# EAGLE schematic rcio_v2 (EAGLE 9.6.2)
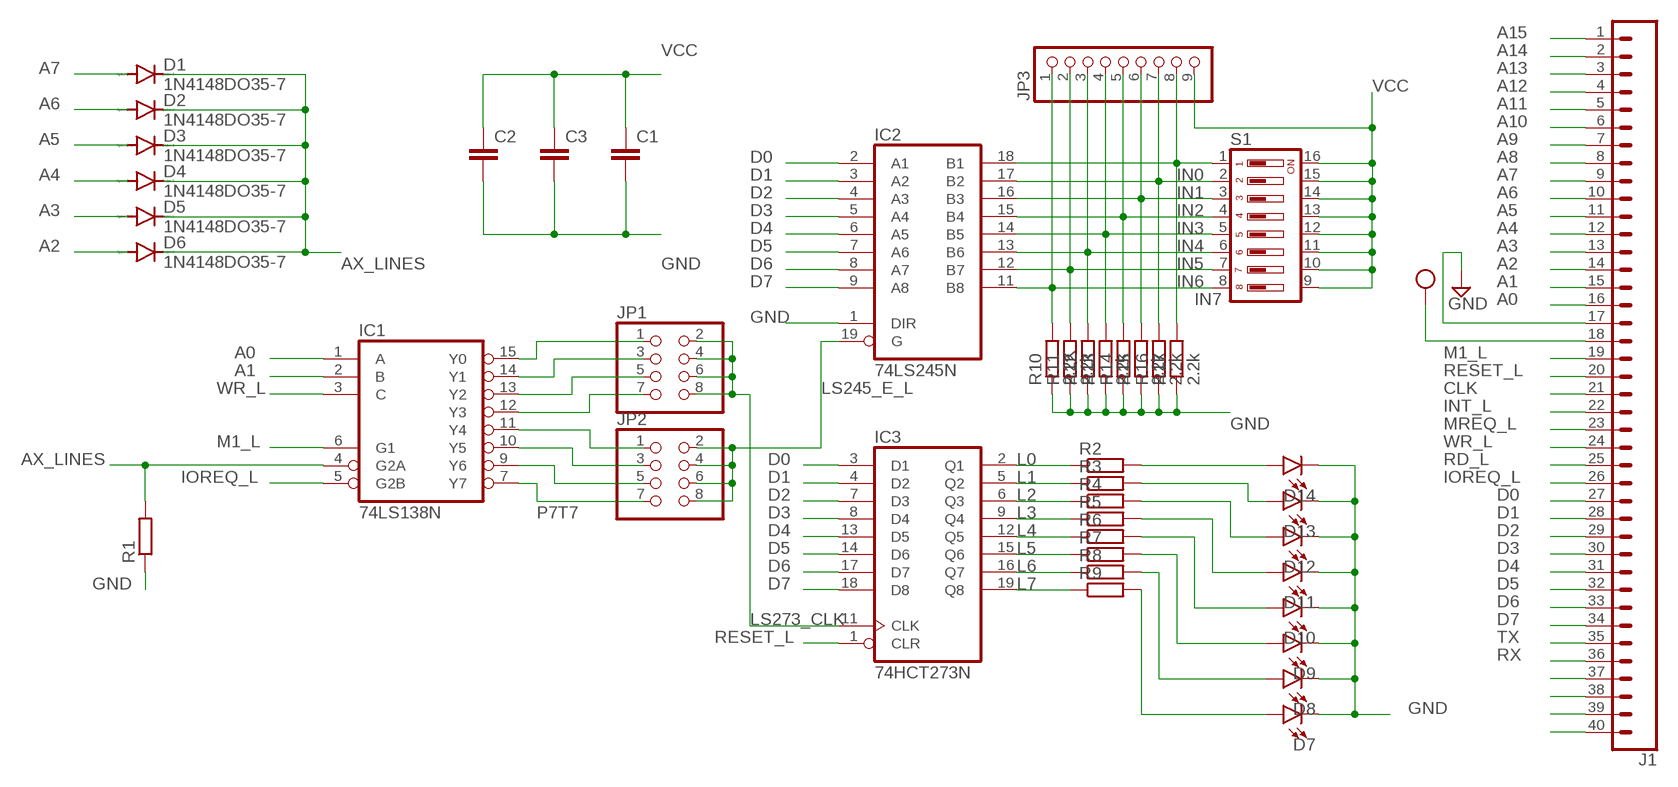
[diagram p0: schematic, sheet 1]

## Parts
C1  C-EU050-025X075  [C050-025X075]
C2  C-EU050-025X075  [C050-025X075]
C3  C-EU050-025X075  [C050-025X075]
D1  1N4148DO35-7  [DO35-7]
D2  1N4148DO35-7  [DO35-7]
D3  1N4148DO35-7  [DO35-7]
D4  1N4148DO35-7  [DO35-7]
D5  1N4148DO35-7  [DO35-7]
D6  1N4148DO35-7  [DO35-7]
D7  LED3MM  [LED_3MM]
D8  LED3MM  [LED_3MM]
D9  LED3MM  [LED_3MM]
D10  LED3MM  [LED_3MM]
D11  LED3MM  [LED_3MM]
D12  LED3MM  [LED_3MM]
D13  LED3MM  [LED_3MM]
D14  LED3MM  [LED_3MM]
IC1  74LS138N  [DIL16]
IC2  74LS245N  [DIL20]
IC3  74HCT273N  [DIL20]
J1  CONN_40OFFSET  [1X40_OFFSET]
JP1  PINHD-2X4  [2X04]
JP2  PINHD-2X4  [2X04]
JP3  PINHD-1X9  [1X09]
R1  R-EU_0204/7  [0204/7]
R2  R-EU_0204/7  [0204/7]
R3  R-EU_0204/7  [0204/7]
R4  R-EU_0204/7  [0204/7]
R5  R-EU_0204/7  [0204/7]
R6  R-EU_0204/7  [0204/7]
R7  R-EU_0204/7  [0204/7]
R8  R-EU_0204/7  [0204/7]
R9  R-EU_0204/7  [0204/7]
R10  2.2K  R-EU_0204/7  [0204/7]
R11  2.2k  R-EU_0204/7  [0204/7]
R12  R-EU_0204/7  [0204/7]
R13  2.2k  R-EU_0204/7  [0204/7]
R14  R-EU_0204/7  [0204/7]
R15  2.2k  R-EU_0204/7  [0204/7]
R16  2.2k  R-EU_0204/7  [0204/7]
R17  2.2k  R-EU_0204/7  [0204/7]
S1  DP08  [DP-08]

## Nets
A0: IC1.1(A) J1.16
A1: IC1.2(B) J1.15
A2: D6.A J1.14
A3: D5.A J1.13
A4: D4.A J1.12
A5: D3.A J1.11
A6: D2.A J1.10
A7: D1.A J1.9
A8: J1.8
A9: J1.7
A10: J1.6
A11: J1.5
A12: J1.4
A13: J1.3
A14: J1.2
A15: J1.1
AX_LINES: D1.C D2.C D3.C D4.C D5.C D6.C IC1.4(G2A) R1.2
CLK: J1.21
D0: IC2.2(A1) IC3.3(D1) J1.27
D1: IC2.3(A2) IC3.4(D2) J1.28
D2: IC2.4(A3) IC3.7(D3) J1.29
D3: IC2.5(A4) IC3.8(D4) J1.30
D4: IC2.6(A5) IC3.13(D5) J1.31
D5: IC2.7(A6) IC3.14(D6) J1.32
D6: IC2.8(A7) IC3.17(D7) J1.33
D7: IC2.9(A8) IC3.18(D8) J1.34
GND: C1.2 C2.2 C3.2 D7.K(C) D8.K(C) D9.K(C) D10.K(C) D11.K(C) D12.K(C) D13.K(C) D14.K(C) IC2.1(DIR) J1.17 R1.1 R10.1 R11.1 R12.1 R13.1 R14.1 R15.1 R16.1 R17.1
IN0: IC2.18(B1) JP3.8 R17.2 S1.1
IN1: IC2.17(B2) JP3.7 R16.2 S1.2
IN2: IC2.16(B3) JP3.6 R15.2 S1.3
IN3: IC2.15(B4) JP3.5 R14.2 S1.4
IN4: IC2.14(B5) JP3.4 R13.2 S1.5
IN5: IC2.13(B6) JP3.3 R12.2 S1.6
IN6: IC2.12(B7) JP3.2 R11.2 S1.7
IN7: IC2.11(B8) JP3.1 R10.2 S1.8
INT_L: J1.22
IOREQ_L: IC1.5(G2B) J1.26
L0: IC3.2(Q1) R2.1
L1: IC3.5(Q2) R3.1
L2: IC3.6(Q3) R4.1
L3: IC3.9(Q4) R5.1
L4: IC3.12(Q5) R6.1
L5: IC3.15(Q6) R7.1
L6: IC3.16(Q7) R8.1
L7: IC3.19(Q8) R9.1
LED7: D7.A R9.2
LS245_E_L: IC2.19(G) JP2.2 JP2.4 JP2.6 JP2.8
LS273_CLK: IC3.11(CLK) JP1.2 JP1.4 JP1.6 JP1.8
M1_L: IC1.6(G1) J1.19
MREQ_L: J1.23
N$1: J1.37
N$2: J1.38
N$3: J1.39
N$4: IC1.15(Y0) JP1.1
N$5: IC1.14(Y1) JP1.3
N$6: IC1.13(Y2) JP1.5
N$7: IC1.12(Y3) JP1.7
N$8: IC1.11(Y4) JP2.1
N$9: IC1.10(Y5) JP2.3
N$10: IC1.9(Y6) JP2.5
N$13: J1.40
N$23: D14.A R2.2
N$24: D13.A R3.2
N$25: D12.A R4.2
N$26: D11.A R5.2
N$27: D10.A R6.2
N$28: D9.A R7.2
N$29: D8.A R8.2
P7T7: IC1.7(Y7) JP2.7
RD_L: J1.25
RESET_L: IC3.1(CLR) J1.20
RX: J1.36
TX: J1.35
VCC: C1.1 C2.1 C3.1 J1.18 JP3.9 S1.9 S1.10 S1.11 S1.12 S1.13 S1.14 S1.15 S1.16
WR_L: IC1.3(C) J1.24

## Power pins joined to a net without a drawn wire
GND: IC1.8(GND) IC2.10(GND) IC3.10(GND)
VCC: IC1.16(VCC) IC2.20(VCC) IC3.20(VCC)

## Library data of the parts
C1 = rcl:C-EU: CAPACITOR, European symbol; SPICEPREFIX: C
C2 C3 = LabE:C-EU: CAPACITOR, European symbol; SPICEPREFIX: C
D1-D6 = diode:1N4148: DIODE high speed (Philips)
D7-D14 = SparkFun-LED:LED: LED (Generic) Standard schematic elements and footprints for 5mm, 3mm, 1206, and 0603 sized LEDs. Generic LEDs with no color specified.; PROD_ID: DIO-08794
IC1 = 74xx-eu:74*138: 3-line to 8-line DECODER/DEMULTIPLEXER
IC2 = 74xx-eu:74*245: Octal BUS TRANSCEIVER, 3-state
IC3 = 74xx-eu:74*273: Octal D type FLIP FLOP, clear
J1 = SparkFun-Connectors:CONN_40: Multi connection point. Often used as Generic Header-pin footprint for 0.1 inch spaced/style header connections On any of the 0.1 inch spaced packages, you can populate with these: Break Away Headers - Straight <https://www.sparkfun.com/products/116> (PRT-00116) Break Away Male Headers - Right Angle <https://www.sparkfun.com/products/553> (PRT-00553) Female Headers <https://www.sparkfun.com/products/115> (PRT-00115) Break Away Headers - Machine Pin <https://www.sparkfun.com/products/117> (PRT-00117) Break Away Female Headers - Swiss Machine Pin <https://www.sparkfun.com/products/743> (PRT-00743) For SCREWTERMINALS and SPRING TERMINALS visit here: Screw Terimnals on SparkFun.com <https://www.sparkfun.com/search/results?term=Screw+Terminals> (5mm/3.5mm/2.54mm spacing) This device is also useful as a general connection point to wire up your design to another part of your project. Our various solder wires solder well into these plated through hole pads. Hook-Up Wire - Assortment (Stranded, 22 AWG) <https://www.sparkfun.com/products/11375> (PRT-11375) Hook-Up Wire - Assortment (Solid Core, 22 AWG) <https://www.sparkfun.com/products/11367> (PRT-11367) View the entire wire category on our website here <https://www.sparkfun.com/categories/141> Special notes: Molex polarized connector foot print use with SKU : PRT-08231 with associated crimp pins and housings. 1MM SMD Version SKU: PRT-10208 NOTES ON THE VARIANTS LOCK and LOCK_LONGPADS... This footprint was designed to help hold the alignment of a through-hole component (i.e. 6-pin header) while soldering it into place. You may notice that each hole has been shifted either up or down by 0.005 of an inch from it's more standard position (which is a perfectly straight line). This slight alteration caused the pins (the squares in the middle) to touch the edges of the holes. Because they are alternating, it causes a "brace" to hold the component in place. 0.005 has proven to be the perfect amount of "off-center" position when using our standard breakaway headers. Although looks a little odd when you look at the bare footprint, once you have a header in there, the alteration is very hard to notice. Also,if you push a header all the way into place, it is covered up entirely on the bottom side.
JP1 JP2 = pinhead:PINHD-2X4: PIN HEADER
JP3 = pinhead:PINHD-1X9: PIN HEADER
R1-R17 = rcl:R-EU_: RESISTOR, European symbol; SPICEPREFIX: R
S1 = switch-dil:DP08: DIL/CODE SWITCH; MPN: DP08; OC_FARNELL: 9471626; OC_NEWARK: 73J0035